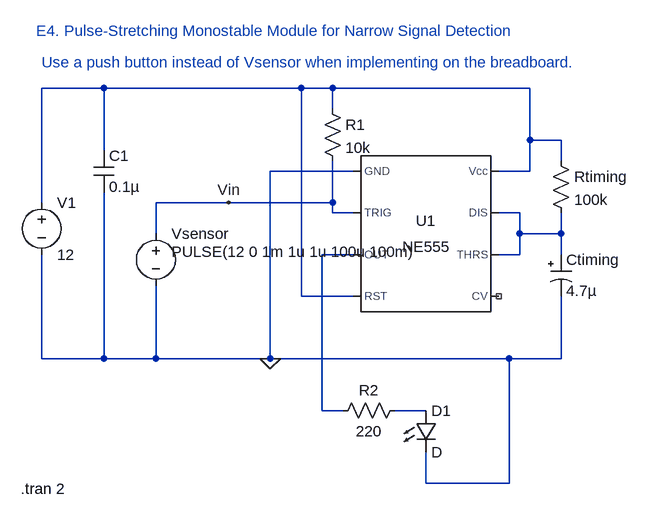
[diagram p0: schematic Pulse-Stretching Monostable Module .asc]
Pulse-Stretching Monostable Module .asc, the LTspice schematic file:
Version 4
SHEET 1 880 680
WIRE -256 -80 -352 -80
WIRE 48 -80 -256 -80
WIRE 96 -80 48 -80
WIRE 400 -80 96 -80
WIRE 96 -48 96 -80
WIRE 400 0 400 -80
WIRE 448 0 400 0
WIRE -256 16 -256 -80
WIRE 448 32 448 0
WIRE 128 48 0 48
WIRE 400 48 400 0
WIRE 400 48 352 48
WIRE -352 96 -352 -80
WIRE -64 96 -176 96
WIRE 96 96 96 32
WIRE 96 96 -64 96
WIRE 96 112 96 96
WIRE 128 112 96 112
WIRE 384 112 352 112
WIRE -176 144 -176 96
WIRE 384 144 384 112
WIRE 448 144 448 112
WIRE 448 144 384 144
WIRE 128 176 80 176
WIRE 384 176 384 144
WIRE 384 176 352 176
WIRE 448 176 448 144
WIRE 48 240 48 -80
WIRE 128 240 48 240
WIRE -352 336 -352 176
WIRE -256 336 -256 80
WIRE -256 336 -352 336
WIRE -176 336 -176 224
WIRE -176 336 -256 336
WIRE 0 336 0 48
WIRE 0 336 -176 336
WIRE 368 336 0 336
WIRE 448 336 448 240
WIRE 448 336 368 336
WIRE 80 416 80 176
WIRE 112 416 80 416
WIRE 240 416 192 416
WIRE 240 528 240 480
WIRE 368 528 368 336
WIRE 368 528 240 528
FLAG 0 336 0
FLAG -64 96 Vin
SYMBOL Misc\\NE555 240 144 R0
SYMATTR InstName U1
SYMBOL voltage -352 80 R0
SYMATTR InstName V1
SYMATTR Value 12
SYMBOL cap -272 16 R0
SYMATTR InstName C1
SYMATTR Value 0.1µ
SYMBOL res 432 16 R0
SYMATTR InstName Rtiming
SYMATTR Value 100k
SYMBOL polcap 432 176 R0
SYMATTR InstName Ctiming
SYMATTR Value 4.7µ
SYMBOL res 80 -64 R0
SYMATTR InstName R1
SYMATTR Value 10k
SYMBOL voltage -176 128 R0
WINDOW 3 24 44 Left 2
WINDOW 123 0 0 Left 0
WINDOW 39 0 0 Left 0
SYMATTR InstName Vsensor
SYMATTR Value PULSE(12 0 1m 1u 1u 100u 100m)
SYMBOL LED 224 416 R0
SYMATTR InstName D1
SYMBOL res 208 400 R90
WINDOW 0 0 56 VBottom 2
WINDOW 3 32 56 VTop 2
SYMATTR InstName R2
SYMATTR Value 220
TEXT -384 536 Left 2 !.tran 2
TEXT -352 -120 Left 2 ;Use a push button instead of Vsensor when implementing on the breadboard.
TEXT -360 -168 Left 2 ;E4. Pulse-Stretching Monostable Module for Narrow Signal Detection

The netlist it stands for:
* Pulse-Stretching Monostable Module .asc
XU1 0 Vin N003 N001 NC_01 N002 N002 N001 NE555  ; pins GND TRIG OUT RST CV THRS DIS Vcc
V1 N001 0 12
C1 N001 0 0.1µ
Rtiming N001 N002 100k
Ctiming N002 0 4.7µ
R1 N001 Vin 10k
Vsensor Vin 0 PULSE(12 0 1m 1u 1u 100u 100m)
D1 N004 0 D
R2 N004 N003 220
.model D D
.lib standard.dio
.tran 2
* Use a push button instead of Vsensor when implementing on the breadboard.
* E4. Pulse-Stretching Monostable Module for Narrow Signal Detection
.lib NE555.sub
.backanno
.end